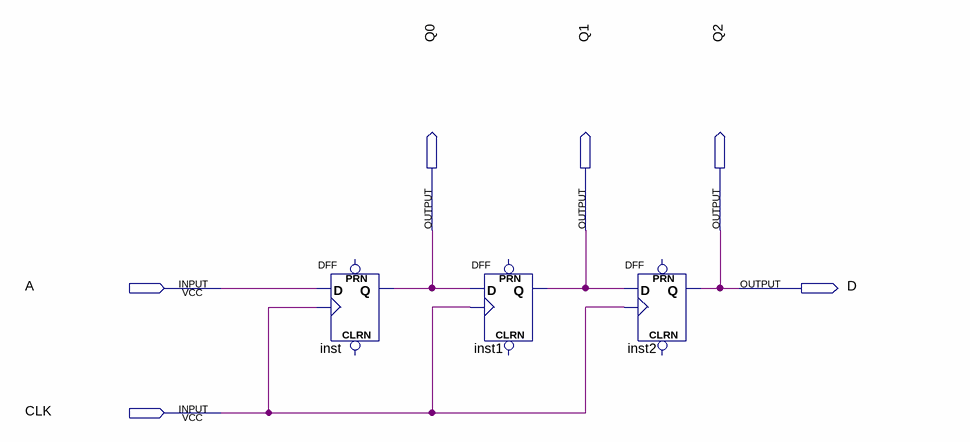
[diagram p0: schematic sheet]
// Quartus schematic Block1.bdf as structural Verilog: 3 symbols, 6 pins
module Block1 (
  input  A,
  input  CLK,
  output Q0,
  output Q1,
  output Q2,
  output D
);

  DFF inst (.CLK(CLK), .D(A), .Q(Q0));  // open: CLRN, PRN
  DFF inst1 (.CLK(CLK), .D(Q0), .Q(Q1));  // open: CLRN, PRN
  DFF inst2 (.CLK(CLK), .D(Q1), .Q(D));  // open: CLRN, PRN

  assign Q2 = D;
endmodule
